# EAGLE design livia-90-semi-auto-board (EAGLE 8.7.1)
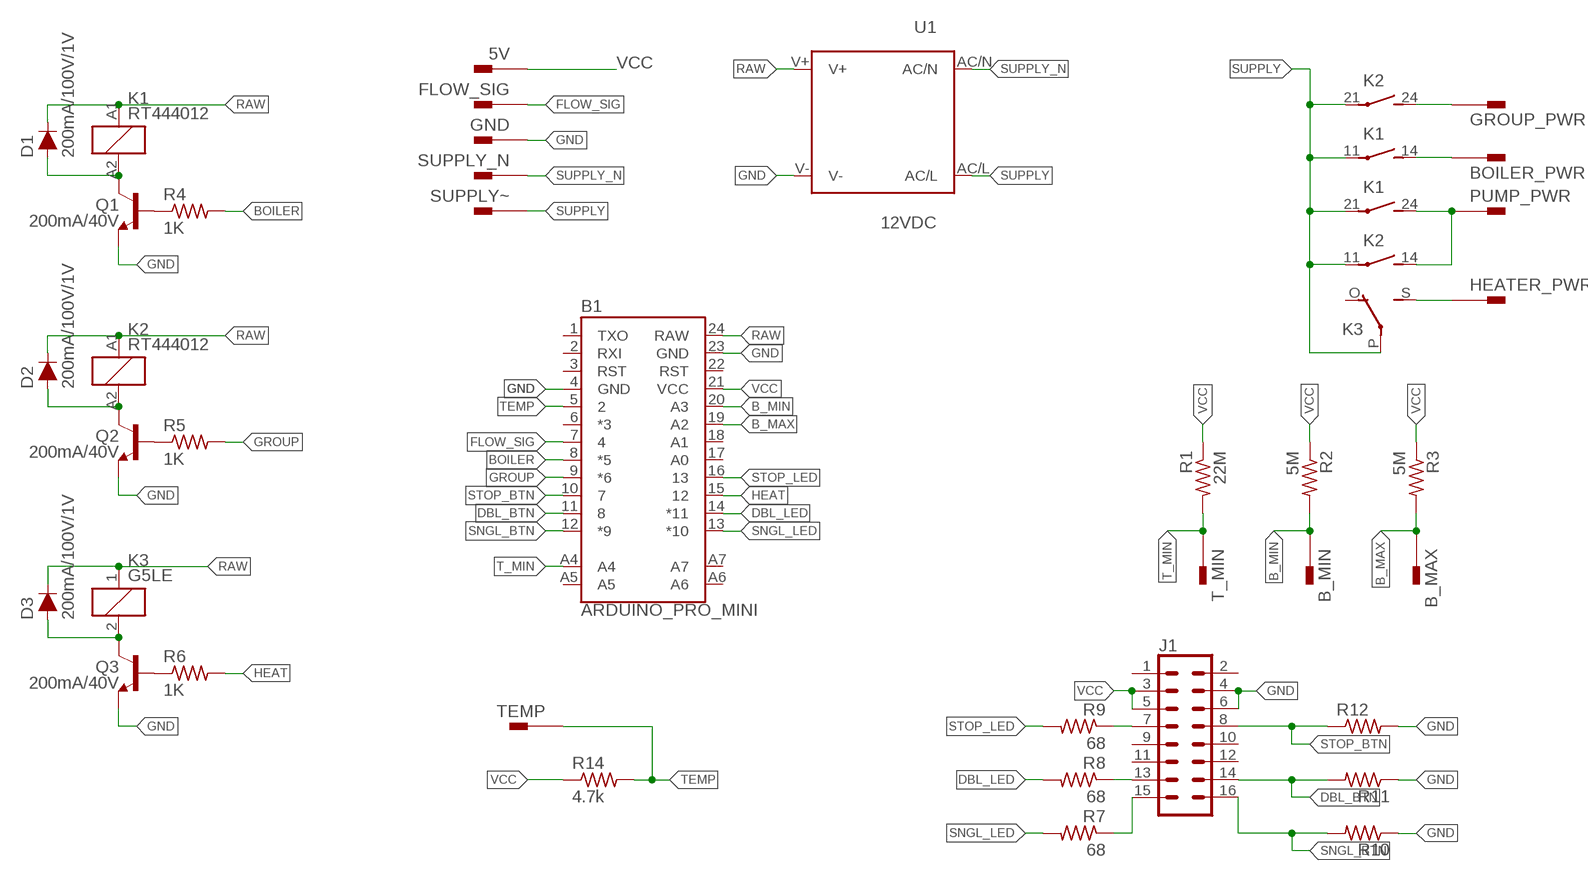
[diagram p0: schematic, sheet 1]

## Parts
5V  PIN2F061.040  [F061.040]
B1  ARDUINO_PRO_MINI  [ARDUINO_PRO_MINI]
B_MAX  PIN2F061.040  [F061.040]
B_MIN  PIN2F061.040  [F061.040]
BOILER_PWR  PIN2F061.040  [F061.040]
D1  200mA/100V/1V  DIODE-1N4148  [DIODE-1N4148]
D2  200mA/100V/1V  DIODE-1N4148  [DIODE-1N4148]
D3  200mA/100V/1V  DIODE-1N4148  [DIODE-1N4148]
FLOW_SIG  PIN2F061.040  [F061.040]
GND  PIN2F061.040  [F061.040]
GROUP_PWR  PIN2F061.040  [F061.040]
HEATER_PWR  PIN2F061.040  [F061.040]
J1  CONN_08X2  [2X8]
K1  RT444012  [RT2N/O]
K2  RT444012  [RT2N/O]
K3  G5LE  [G5LE]
PUMP_PWR  PIN2F061.040  [F061.040]
Q1  200mA/40V  TRANS_NPN-2N3904  [TO-92]
Q2  200mA/40V  TRANS_NPN-2N3904  [TO-92]
Q3  200mA/40V  TRANS_NPN-2N3904  [TO-92]
R1  22M  R-US_0207/7  [0207/7]
R2  5M  R-US_0207/7  [0207/7]
R3  5M  R-US_0207/7  [0207/7]
R4  1K  R-US_0207/7  [0207/7]
R5  1K  R-US_0207/7  [0207/7]
R6  1K  R-US_0207/7  [0207/7]
R7  68  R-US_0207/7  [0207/7]
R8  68  R-US_0207/7  [0207/7]
R9  68  R-US_0207/7  [0207/7]
R10  R-US_0207/7  [0207/7]
R11  R-US_0207/7  [0207/7]
R12  R-US_0207/7  [0207/7]
R14  4.7k  R-US_0207/7  [0207/7]
SUPPLY_N  PIN2F061.040  [F061.040]
SUPPLY~  PIN2F061.040  [F061.040]
T_MIN  PIN2F061.040  [F061.040]
TEMP  PIN2F061.040  [F061.040]
U1  12VDC  IRM_05/10  [IRM_05/10]

## Nets
B_MAX: B1.19(A2) B_MAX.A1 B_MAX.A2 R3.2
B_MIN: B1.20(A3) B_MIN.A1 B_MIN.A2 R2.2
BOILER: B1.8(*5) R4.2
DBL_BTN: B1.11 J1.14 R11.2
DBL_LED: B1.14(*11) R8.2
FLOW_SIG: B1.7 FLOW_SIG.A1 FLOW_SIG.A2
GND: B1.4(GND) B1.23(GND) GND.A1 GND.A2 J1.4 J1.6 Q1.1(E) Q2.1(E) Q3.1(E) R10.1 R11.1 R12.2 U1.V-
GROUP: B1.9(*6) R5.2
HEAT: B1.15 R6.2
N$2: GROUP_PWR.A1 GROUP_PWR.A2 K2.24(3:S)
N$5: Q1.2(B) R4.1
N$9: Q2.2(B) R5.1
N$10: K1.24(3:S) K2.14(2:S) PUMP_PWR.A1 PUMP_PWR.A2
N$12: HEATER_PWR.A1 HEATER_PWR.A2 K3.S(2:S)
N$13: Q3.2(B) R6.1
N$14: J1.7 R9.1
N$16: D3.A K3.2 Q3.3(C)
N$18: D2.A K2.A2 Q2.3(C)
N$19: BOILER_PWR.A1 BOILER_PWR.A2 K1.14(2:S)
N$20: D1.A K1.A2 Q1.3(C)
N$23: J1.13 R8.1
N$24: J1.15 R7.1
RAW: B1.24(RAW) D1.C D2.C D3.C K1.A1 K2.A1 K3.1 U1.V+
SNGL_BTN: B1.12(*9) J1.16 R10.2
SNGL_LED: B1.13(*10) R7.2
STOP_BTN: B1.10 J1.8 R12.1
STOP_LED: B1.16 R9.2
SUPPLY: K1.11(2:P) K1.21(3:P) K2.11(2:P) K2.21(3:P) K3.P(2:P) SUPPLY~.A1 SUPPLY~.A2 U1.AC/L
SUPPLY_N: SUPPLY_N.A1 SUPPLY_N.A2 U1.AC/N
T_MIN: B1.A4 R1.2 T_MIN.A1 T_MIN.A2
TEMP: B1.5 R14.2 TEMP.A1 TEMP.A2
VCC: 5V.A1 5V.A2 B1.21(VCC) J1.3 J1.5 R1.1 R2.1 R3.1 R14.1
Unconnected: B1.1(TXO) B1.2(RXI) B1.3(RST) B1.6(*3) B1.17(A0) B1.18(A1) B1.22(RST) B1.A5 B1.A6 B1.A7 J1.1 J1.2 J1.9 J1.10 J1.11 J1.12 K3.O(2:O)

## Library data of the parts
5V B_MAX B_MIN BOILER_PWR FLOW_SIG GND GROUP_PWR HEATER_PWR PUMP_PWR SUPPLY_N SUPPLY~ T_MIN TEMP = con-faston:PIN2: Flachstecker Typ Tyco/Electronics/AMP TAB, FASTON Printed Circuit Board Tabs Source: http://www.buerklin.com, http://catalog.tycoelectronics.com; OC_FARNELL: unknown; OC_NEWARK: unknown
B1 = SparkFun-Boards:ARDUINO_PRO_MINI: SparkFun Pro Mini Pro Mini compatible footprint. Dimensions: 0.7 x 1.3" PCB Thickness: 0.8mm SparkFun Products: 3.3V/8MHz <https://www.sparkfun.com/products/11114> 5V/16MHz <https://www.sparkfun.com/products/11113>
D1-D3 = SparkFun-DiscreteSemi:DIODE: Diode These are standard reverse protection diodes and small signal diodes. SparkFun Products: SparkFun SparkPunk Sound Kit <https://www.sparkfun.com/products/11177> SparkFun ESP8266 Thing <https://www.sparkfun.com/products/13231>; PROD_ID: DIO-08378
J1 = SparkFun-Connectors:CONN_08X2: Multi connection point. Often used as Generic Header-pin footprint for 0.1 inch spaced/style header connections You can populate with any combo of single row headers, but if you'd like an exact match, check this: Header - 2x8 (Male, 0.1") <https://www.sparkfun.com/products/13156> (PRT-13156) On any of the 0.1 inch spaced packages, you can populate with these: Break Away Headers - Straight <https://www.sparkfun.com/products/116> (PRT-00116) Break Away Male Headers - Right Angle <https://www.sparkfun.com/products/553> (PRT-00553) Female Headers <https://www.sparkfun.com/products/115> (PRT-00115) Break Away Headers - Machine Pin <https://www.sparkfun.com/products/117> (PRT-00117) Break Away Female Headers - Swiss Machine Pin <https://www.sparkfun.com/products/743> (PRT-00743)
K1 K2 = relay:RT44?*: Power PCB Relay SCHRACK 2 pole 8 A, DC and AC-coil Source: http://www.schrack.com/.. 5842.pdf; OC_FARNELL: unknown; OC_NEWARK: unknown
K3 = relay:G5LE: RELAY 1 x switch, 10 A/120 V AC, 8 A/30 V DC, Omron; OC_FARNELL: unknown; OC_NEWARK: unknown
Q1-Q3 = SparkFun-DiscreteSemi:TRANS_NPN: NPN transistor Current controlled devices typically used to amplify current or used as a switch. BC547 - COM-08928 <http://www.sparkfun.com/products/8928> (TO-92 45V 100mA) (1.Collector 2.Base 3.Emitter) 2N3904 - COM-00521 <http://www.sparkfun.com/products/521> (TO-92 40V 200mA) (1.Emitter 2.Base 3.Collector) P2N2222A - COM-12852 <http://www.sparkfun.com/products/12852> (TO-92 40V 600mA) (1.Collector 2.Base 3.Emitter); PROD_ID: TRANS-08447
R1-R12 R14 = rcl:R-US_: RESISTOR, American symbol; SPICEPREFIX: R
U1 = meanwell_irm_v5:IRM_05/10: 5 or 10 watt housing & pin compatible IRM 05 Vout [V] Imax [A] Pmax [W] Eff [%] 3.3 1.25 4.125 68 5 1 5 71 12 0.42 5.04 75 15 0.33 4.95 75 24 0.23 5.52 77 IRM 10 Vout [V] Imax [A] Pmax [W] Eff [%] 3.3 2.5 8.25 74 5 2 10 77 12 0.85 10.2 82 15 0.67 10.05 82 24 0.42 10.08 82

## Board
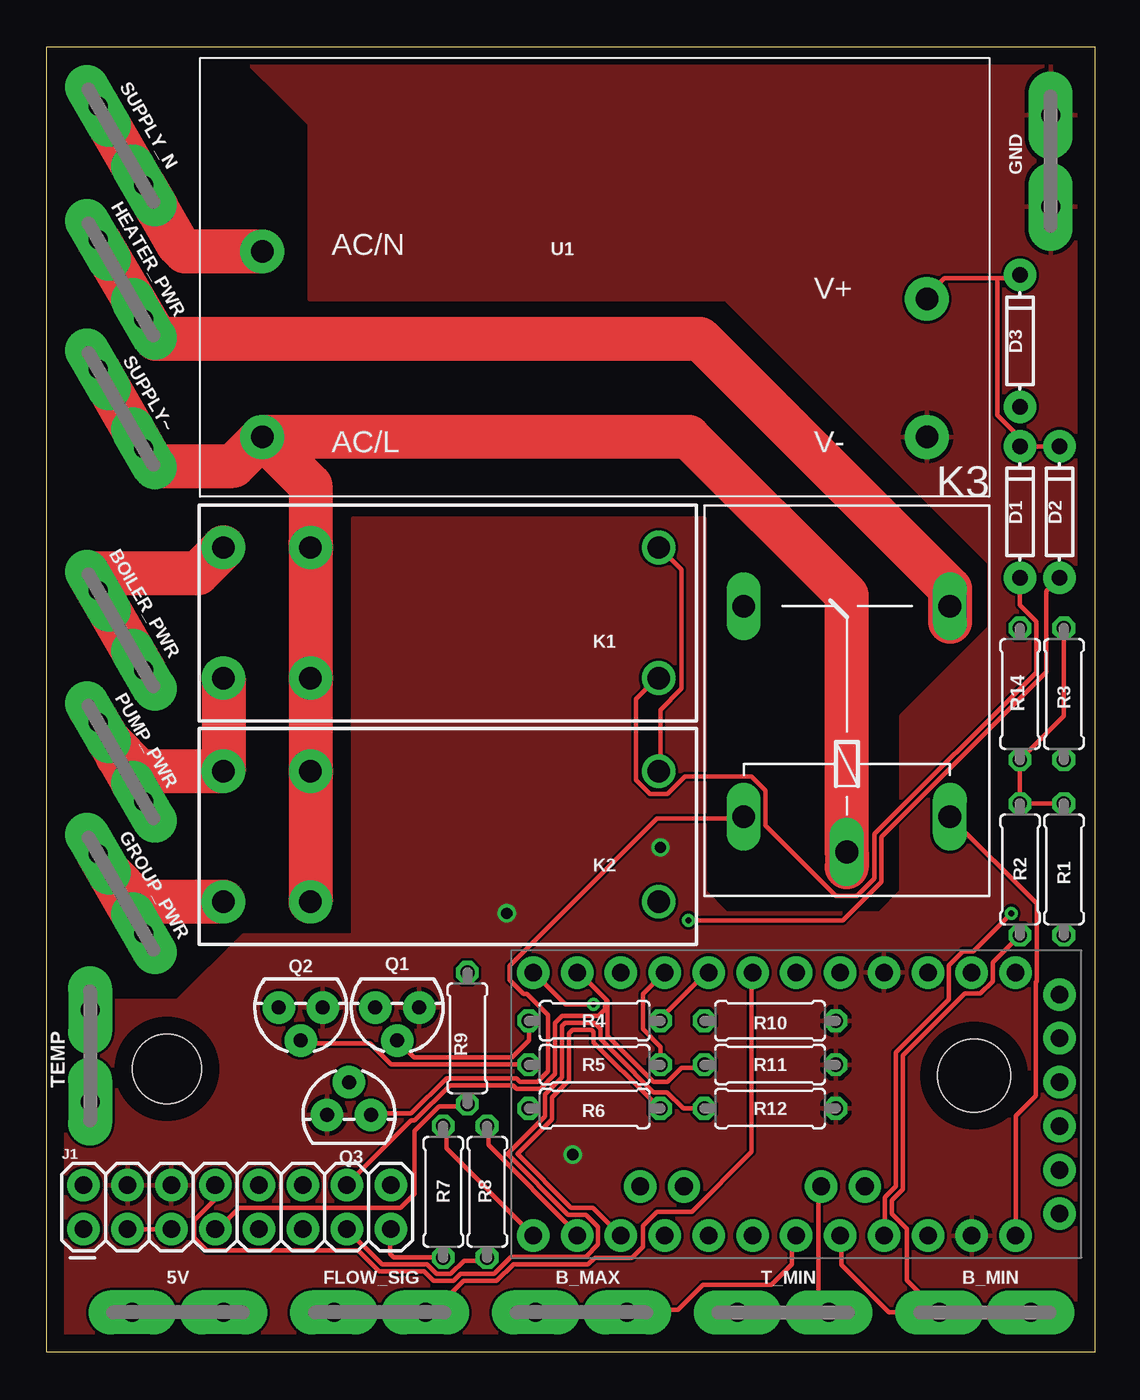
[diagram p1: board, top side]
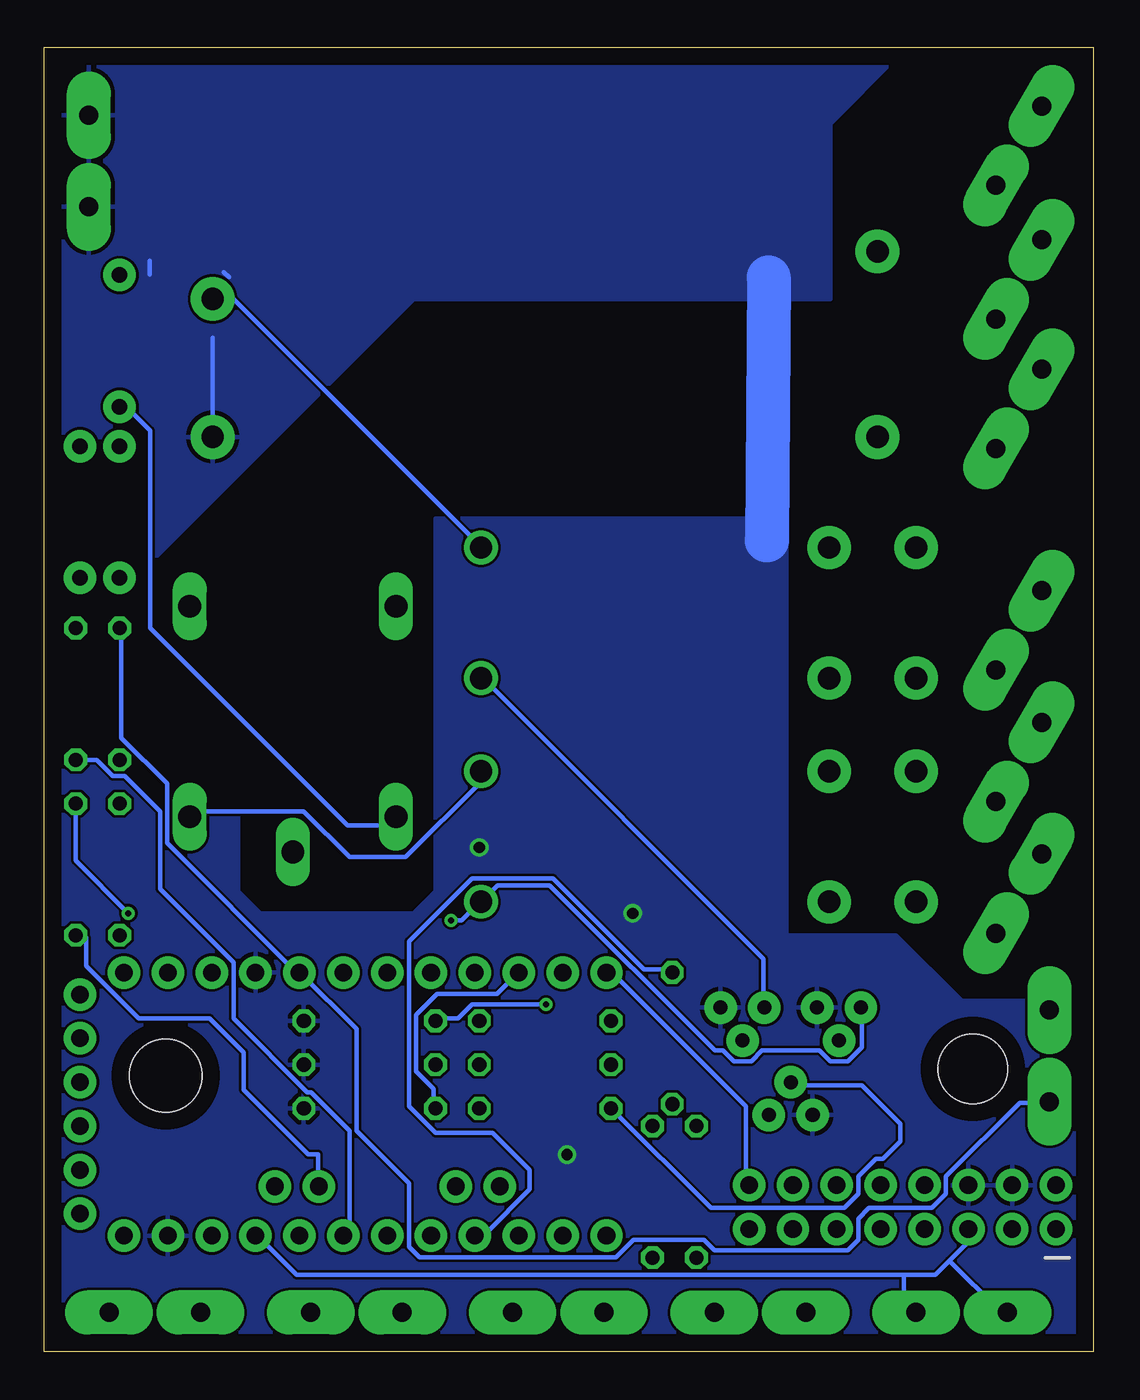
[diagram p2: board, bottom side, seen from below]

Size 60.76 x 75.56 mm. Coordinates in mm from the lower left corner, seen from the top.
Outline: 0,0 60.76,0 60.76,75.56 0,75.56 0,0
Copper layers (1*16): Top 0.035mm / dielectric 1.5mm / Bottom 0.035mm
Design rules "default *": minimum track width 10mil, minimum drill 0.35mm, track to track 6mil, track to pad 6mil, pad to pad 6mil, via to via 6mil, smd to smd 6mil, copper to edge 40mil, drill to drill 6mil, minimum pad ring 10mil, minimum via ring 8mil, stop-mask expansion 4mil, vias tented up to drill 0mil, thermal gap 10mil
Holes 4.2 mm at 53.72,16
Holes 4 mm at 6.99,16.38

### Footprints (pad centres in the part's own frame; a part is rotated, then mirrored left to right if it is on the bottom)
F061.040 = drill 1.1 pad 2.54 long: A1 -2.65,0; A2 2.65,0
ARDUINO_PRO_MINI = drill 1.016 pad 1.88: 1 -7.62,12.7; 2 -7.62,10.16; 3 -7.62,7.62; 4 -7.62,5.08; 5 -7.62,2.54; 6 -7.62,0; 7 -7.62,-2.54; 8 -7.62,-5.08; 9 -7.62,-7.62; 10 -7.62,-10.16; 11 -7.62,-12.7; 12 -7.62,-15.24; 13 7.62,-15.24; 14 7.62,-12.7; 15 7.62,-10.16; 16 7.62,-7.62; 17 7.62,-5.08; 18 7.62,-2.54; 19 7.62,0; 20 7.62,2.54; 21 7.62,5.08; 22 7.62,7.62; 23 7.62,10.16; 24 7.62,12.7; A4 4.763,1.429; A5 4.763,3.969; A6 4.763,-9.049; A7 4.763,-6.509; BLK -6.35,15.24; GND -3.81,15.24; GRN 6.35,15.24; RXI 1.27,15.24; TXO 3.81,15.24; VCC -1.27,15.24
DIODE-1N4148 = drill 0.9 pad 1.88: A -3.81,0; C 3.81,0
2X8 = drill 1.016 pad 1.88: 1 0,0; 2 0,2.54; 3 2.54,0; 4 2.54,2.54; 5 5.08,0; 6 5.08,2.54; 7 7.62,0; 8 7.62,2.54; 9 10.16,0; 10 10.16,2.54; 11 12.7,0; 12 12.7,2.54; 13 15.24,0; 14 15.24,2.54; 15 17.78,0; 16 17.78,2.54
RT2N/O = drill 1.3 pad 2.5: 11 7.56,-3.78; 14 12.6,-3.78; 21 7.56,3.78; 24 12.6,3.78 | drill 1.3: A1 -12.6,-3.78; A2 -12.6,3.78
G5LE = drill 1.321 long: 1 -7.493,-5.969; 2 -7.493,5.969; O 4.699,5.969; P -9.525,0; S 4.699,-5.969
TO-92 = drill 0.813 pad 1.88: 1 -1.27,0; 2 0,1.905; 3 1.27,0
0207/7 = drill 0.813 octagon: 1 -3.81,0; 2 3.81,0
IRM_05/10 = drill 1.3 pad 2.54: AC/L -19.25,-9.25; AC/N -19.25,1.5; V+ 19.25,-1.25; V- 19.25,-9.25

### Placement (x,y rotation side)
5V  7.62,2.29 180 top
B1  43.43,14.35 270 top
B_MAX  30.99,2.29 180 top
B_MIN  54.36,2.29 0 top
BOILER_PWR  4.32,41.78 120 top
D1  56.39,48.64 90 top
D2  58.67,48.64 90 top
D3  56.39,58.55 90 top
FLOW_SIG  19.3,2.29 180 top
GND  58.17,68.96 90 top
GROUP_PWR  4.32,26.54 300 top
HEATER_PWR  4.32,62.1 120 top
J1  2.16,7.11 0 top
K1  22.86,42.8 180 top
K2  22.86,29.84 180 top
K3  46.35,38.48 90 top
PUMP_PWR  4.32,34.16 120 top
Q1  20.32,19.94 180 top
Q2  14.73,19.94 180 top
Q3  17.53,13.72 0 top
R1  58.93,27.94 270 top
R2  56.39,27.94 270 top
R3  58.93,38.1 270 top
R4  31.75,19.18 0 top
R5  31.75,16.64 0 top
R6  31.75,14.1 0 top
R7  22.99,9.27 90 top
R8  25.53,9.27 90 top
R9  24.38,18.16 90 top
R10  41.91,19.18 180 top
R11  41.91,16.64 180 top
R12  41.91,14.1 0 top
R14  56.39,38.1 90 top
SUPPLY_N  4.32,69.85 120 top
SUPPLY~  4.32,54.61 120 top
T_MIN  42.67,2.29 0 top
TEMP  2.54,17.14 270 top
U1  31.75,62.23 0 top

### Tracks (layer width: path | path; a pad name or v marks a point on that pad's centre or on a via)
B_MAX
  Top 0.254: B_MAX.A2 28.45,2.44 33.53,2.44 B_MAX.A1 33.73,2.44 36.58,2.44 38.02,3.89 41.99,3.89 43.18,5.08 43.18,6.6 43.28,6.71 B1.19
  Bottom 0.254: B1.19 43.28,6.91 43.08,7.11 43.08,12.8 45.31,15.04 45.52,15.04 49.78,19.3 49.78,22.55 54.05,26.82 54.05,31.29 56.11,33.35 56.78,33.35 57.72,34.29 R3.2
B_MIN
  Top 0.254: B_MIN.A2 B_MIN.A1 | B1.20 46.04,6.67 46.04,5.03 48.78,2.29 B_MIN.A1 | R2.2 54.81,22.55 54.81,21.47 54.1,20.75 53.19,20.75 49.61,17.18 49.61,9.42 48.97,8.77 48.97,8 49.84,7.13 49.84,4.16 B_MIN.A1
BOILER
  Top 0.254: R4.2 35.56,19.3 38.2,21.95 B1.8
DBL_BTN
  Top 0.254: 32.51,20.32 32.51,18.29 35.15,15.65 35.97,15.65 36.78,16.46 38,16.46 R11.2 | 32.51,20.32 30.89,21.95 B1.11 | J1.14 17.48,9.75 21.13,13.41 21.34,13.41 23.37,15.44 27.03,15.44 27.23,15.24 28.62,15.24 29.46,16.09 29.46,19.05 29.87,19.46 31.97,19.46 32.36,19.84 32.36,20.16 32.51,20.32
DBL_LED
  Top 0.254: R8.2 25.6,13.01 25.6,11.99 30.68,6.91 B1.14
FLOW_SIG
  Top 0.254: 22.35,2.44 21.59,2.44 17.27,2.44 FLOW_SIG.A2 | B1.7 40.84,21.95 40.84,11.58 37.39,8.13 35.36,8.13 34.54,7.32 34.54,6.1 33.91,5.46 31.76,5.46 31.38,5.08 27.05,5.08 26.09,4.12 24.16,4.12 23.99,3.95 22.73,2.69 | 22.35,2.44 FLOW_SIG.A1 | 22.35,2.44 22.73,2.44 22.73,2.69 | 22.73,2.69 22.48,2.44 22.35,2.44
GND  (via drill 0.65)
  Top 0.254: GND.A2 58.32,71.93 58.32,66.85 GND.A1 | 48.36,21.95 B1.4 | 45.72,19.3 R10.1
  Bottom 0.254: 51,58.73 51,53.03 U1.V- | 54.66,63.2 54.66,62.38 | 58.12,66.65 GND.A1 | 53.44,6.91 B1.23 | 15.85,20.12 Q2.1 | 50.36,62.53 50.06,62.23
  Bottom 2.54: 18.8,62.23 18.89,46.99 18.92,46.99
  other vias: 30.48,11.43 35.56,29.21 26.67,25.4
  pour Top: 10.16,76.2 15.24,71.12 15.24,60.96 39.37,60.96 54.61,45.72 54.61,41.91 49.53,36.83 49.53,26.67 48.26,25.4 39.37,25.4 38.1,26.67 38.1,48.26 17.78,48.26 17.78,24.13 11.43,24.13 7.62,20.32 0,20.32 0,0 60.96,0 60.96,76.2
  pour Bottom: 11.43,74.93 15.24,71.12 15.24,60.96 39.37,60.96 54.61,45.72 54.61,41.91 49.53,36.83 49.53,26.67 48.26,25.4 39.37,25.4 38.1,26.67 38.1,48.26 17.78,48.26 17.78,24.13 11.43,24.13 7.62,20.32 0,20.32 0,0 60.96,0 60.96,76.2 11.43,76.2
GROUP
  Top 0.254: R5.2 35.56,17.68 34.54,18.69 34.54,20.73 35.76,21.95 B1.9
HEAT
  Top 0.254: 32.07,7.94 B1.15 31.65,8.36 30.39,8.36 27.28,11.46 29.29,13.47 29.29,14.74 30.28,15.73 30.28,18.44 30.48,18.64 31.58,18.64 31.7,18.53 31.7,17.93 35,14.63 35.03,14.63 R6.2
N$2
  Top 0.254: GROUP_PWR.A2 6.22,23.67 6.22,23.24
  Top 2.54: 6.22,23.24 5,25.36 3.59,27.81 | 3.59,27.81 GROUP_PWR.A1 | K2.24 5.33,26.07 3.59,27.81
N$5
  Top 0.254: Q1.2 21.29,17.07 26.98,17.07 27.94,18.03 R4.1
N$9
  Top 0.254: R5.1 27.84,16.66 19.97,16.66 18.75,17.88 14.83,17.88 Q2.2
N$10
  Top 0.254: PUMP_PWR.A2 2.54,36.91 2.54,37.21 | PUMP_PWR.A1 5.69,31.9 PUMP_PWR.A1
  Top 2.54: K1.24 K2.14 5.38,33.62 3.58,35.42 | 2.54,37.21 3.58,35.42 | 3.58,35.42 4.13,34.48 | 4.13,34.48 5,32.97 PUMP_PWR.A1 | PUMP_PWR.A1 | 4.98,33.62 4.13,34.48
N$12
  Top 0.254: HEATER_PWR.A2 3.05,64.41 3.04,64.41
  Top 2.54: 52.32,42.29 K3.S 52.32,44.2 37.85,58.67 6.35,58.67 | HEATER_PWR.A2 6.35,58.67 | HEATER_PWR.A1 6.35,58.67
N$13
  Bottom 0.254: R6.1 27.84,14.02 22.15,8.33 14.43,8.33 13.61,9.14 13.61,10.16 12.6,11.18 12.19,11.18 11.18,12.19 11.18,13.21 13.41,15.44 17.48,15.44 Q3.2
N$14
  Top 0.254: R9.1 24.38,14.22 22.76,14.22 21.34,12.8 21.34,9.14 20.52,8.33 11.18,8.33 9.96,7.11 J1.7
N$16
  Top 0.254: Q3.3 18.9,13.82 21.13,13.82 23.16,15.85 27.23,15.85 27.43,15.65 28.45,15.65 29.06,16.26 29.06,19.51 27.84,20.73 27.64,20.73 26.82,21.54 26.82,22.35 35.36,30.89 40.23,30.89 K3.2
  Bottom 0.254: D3.A 55.88,54.61 54.61,53.34 54.61,41.91 43.18,30.48 40.64,30.48 40.23,30.89 K3.2
N$18  (via drill 0.35)
  Top 0.254: v37.19,24.99 46.13,24.99 48.36,27.23 48.36,29.81 57.91,39.36 57.91,44.07 D2.A
  Bottom 0.254: Q2.3 13.41,19.91 13.41,17.63 14.23,16.82 15.24,16.82 15.87,17.45 19.18,17.45 19.82,16.82 20.82,16.82 21.46,17.45 21.92,17.45 31.5,27.03 34.5,27.03 K2.A2 35.56,26.01 36.58,24.99 v37.19,24.99
N$19
  Top 0.254: 2.41,45.09 2.41,44.66 BOILER_PWR.A2 | 5.08,39.37 5.53,39.37 BOILER_PWR.A1 5.69,39.62 5.6,39.57
  Top 2.54: BOILER_PWR.A1 | BOILER_PWR.A1 5.6,39.57 2.41,45.09 8.77,45.09 K1.14
N$20
  Top 0.254: K1.A2 35.36,39.01 34.14,37.8 34.14,33.12 34.95,32.31 35.97,32.31 36.98,33.33 40.84,33.33 41.66,32.51 41.66,30.48 45.72,26.42 46.94,26.42 47.95,27.43 47.95,29.98 57.33,39.35 57.33,42.3 56.39,43.24 D1.A
  Bottom 0.254: Q1.3 19.1,20.12 19.1,22.76 35.36,39.01 K1.A2
N$23
  Top 0.254: R8.1 25.4,5.28 24.18,5.28 23.42,4.52 22.6,4.52 22.04,5.08 19.43,5.08 J1.13
N$24
  Top 0.254: R7.1 22.96,5.49 20.12,5.49 19.91,5.69 J1.15
RAW
  Top 0.254: K2.A1 35.56,33.73 35.56,37.19 36.78,38.41 36.78,45.31 35.56,46.53 K1.A1 | K3.1 57.35,25.96 57.35,21.47 57.3,21.41 57.3,14.83 56.13,13.66 B1.24 | D2.C 58.52,52.43 56.49,52.43 D1.C 56.29,52.63 56.29,53.03 55.07,54.25 55.07,62.18 | 55.07,62.18 52.02,62.18 51,61.16 U1.V+ | 55.07,62.18 56.29,62.18 D3.C
  Bottom 0.254: K3.1 52.02,31.29 45.72,31.29 43.08,28.65 39.83,28.65 35.56,32.92 35.56,33.53 K2.A1 | U1.V+ 50.8,60.96 49.78,60.96 35.56,46.74 K1.A1
SNGL_BTN  (via drill 0.35)
  Top 0.254: v31.7,20.12 30.07,20.12 28.25,21.95 B1.12
  Bottom 0.254: v31.7,20.12 35.97,20.12 36.78,19.3 38,19.3 R10.2 | J1.16 20.12,9.75 20.12,14.22 28.04,22.15 B1.12
SNGL_LED
  Top 0.254: R7.2 23.16,13.01 23.16,11.79 28.04,6.91 B1.13
STOP_BTN
  Top 0.254: J1.8 9.78,8.84 8.56,7.62 8.56,6.61 9.27,5.89 18.04,5.89 19.26,4.67 21.87,4.67 22.43,4.12 23.59,4.12 23.99,4.52 25.92,4.52 26.91,5.51 31.24,5.51 31.95,6.23 31.95,7.24 31.24,7.95 30.22,7.95 26.7,11.46 28.88,13.64 28.88,14.91 29.87,15.9 29.87,18.88 30.04,19.05 31.75,19.05 32.11,18.69 32.11,18.12 33.02,17.2 33.02,17.19 35.17,15.04 35.95,15.04 36.89,14.1 R12.1
  Bottom 0.254: R12.1 38.2,14.22 38.2,15.24 39.22,16.26 39.22,19.51 38,20.73 34.54,20.73 33.33,21.95 B1.10
STOP_LED
  Bottom 0.254: R9.2 24.38,22.15 26.01,22.15 31.29,27.43 35.97,27.43 39.62,23.77 39.62,14.22 38.1,12.7 34.8,12.7 32.64,10.54 32.64,9.42 35.15,6.91 35.76,6.91 B1.16
SUPPLY
  Top 0.254: 5.08,52.07 5.4,52.07 SUPPLY~.A1 5.64,51.89 6.22,51.31
  Top 2.54: K2.21 K2.11 K1.21 K1.11 | 46.35,28.07 K3.P 46.35,43.81 37.19,52.98 U1.AC/L | SUPPLY~.A2 6.22,51.31 10.83,51.31 U1.AC/L | 15.3,46.84 K1.11 | U1.AC/L 15.3,50.18 K1.11
SUPPLY_N
  Top 2.54: U1.AC/N 8.03,63.73 7.62,64.14 6.48,66.11 | 6.48,66.11 SUPPLY_N.A2 | SUPPLY_N.A1 6.48,66.11
T_MIN
  Top 0.254: 45.31,2.44 44.7,2.44 | 44.7,2.44 40.03,2.44 T_MIN.A1 | 45.31,2.44 T_MIN.A2 | 44.7,2.44 44.7,9.55 B1.A4 | 44.7,2.44 T_MIN.A2 | T_MIN.A1 45.16,2.29 | 45.16,2.29 45.31,2.44 | T_MIN.A2 45.16,2.29 | T_MIN.A1 T_MIN.A2
  Bottom 0.254: R1.2 58.32,23.98 58.32,22.35 55.27,19.3 51.17,19.3 49.21,17.34 49.21,15.17 45.47,11.43 44.91,11.43 44.91,9.75 B1.A4
TEMP
  Top 0.254: TEMP.A2 2.64,14.63 2.64,19.71 TEMP.A1
  Bottom 0.254: R14.2 56.29,41.86 56.29,35.56 53.65,32.92 53.65,29.46 46.13,21.95 B1.5 45.92,21.95 42.67,18.69 42.67,12.8 39.62,9.75 39.62,6.1 39.01,5.49 27.64,5.49 26.62,6.5 22.55,6.5 21.95,5.89 14.22,5.89 13.61,6.5 13.61,7.72 13.01,8.33 9.35,8.33 8.53,9.14 8.53,10.16 4.27,14.43 2.64,14.43 TEMP.A2
VCC  (via drill 0.35)
  Top 0.254: B1.21 48.56,6.91 48.56,8.94 49.21,9.58 49.21,17.34 52.27,20.41 52.27,22.37 53.09,23.19 53.67,23.19 v55.88,25.4 | J1.3 J1.5 | R1.1 R2.1 R14.1 58.93,36.83 R3.1
  Bottom 0.254: 10.97,4.47 9.14,4.47 8.33,5.28 | 10.97,4.47 46.13,4.47 48.36,6.71 B1.21 | J1.5 7.24,6.38 8.33,5.28 | 10.97,4.47 10.97,2.44 5V.A1 | 8.33,5.28 5.49,2.44 5V.A2 | R1.1 58.93,28.45 v55.88,25.4